# EAGLE schematic currentBaseBoard_v5 (EAGLE 9.5.1)
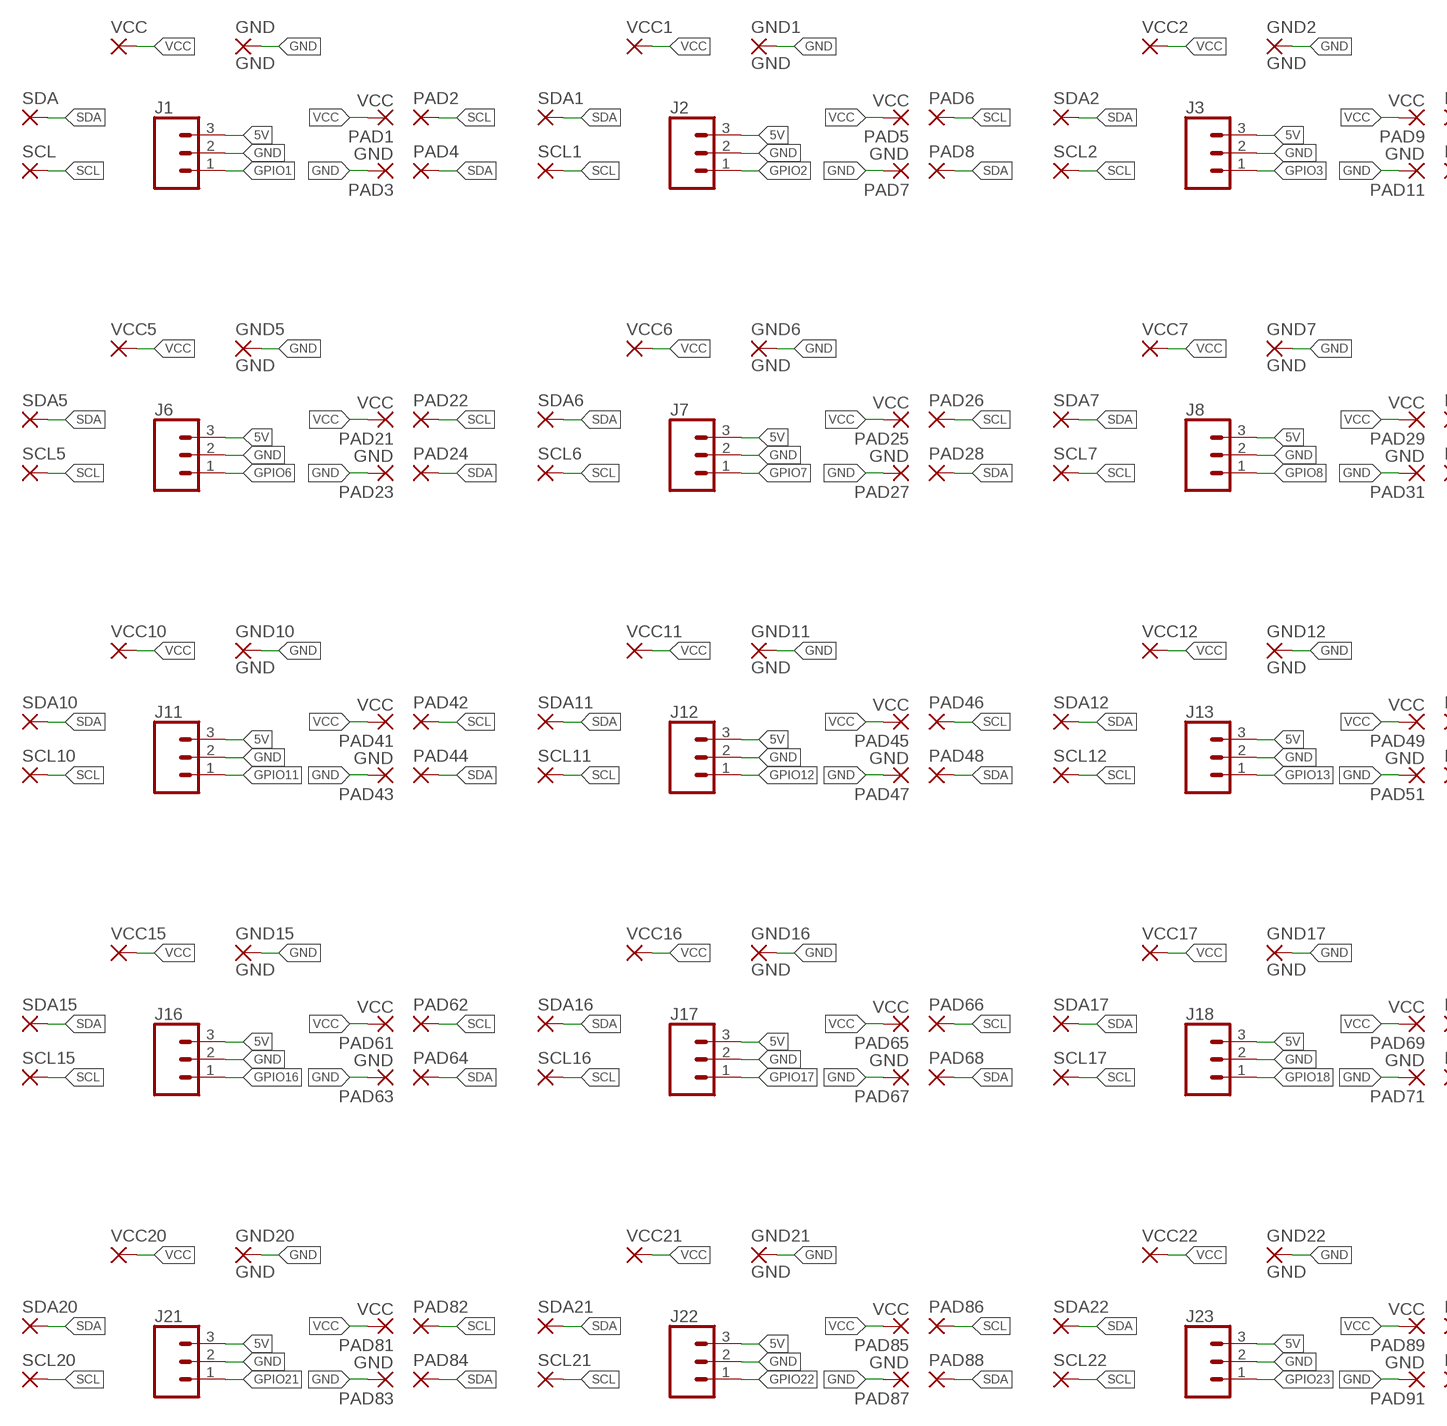
[diagram p0: schematic, sheet 1, part 1 of 2]
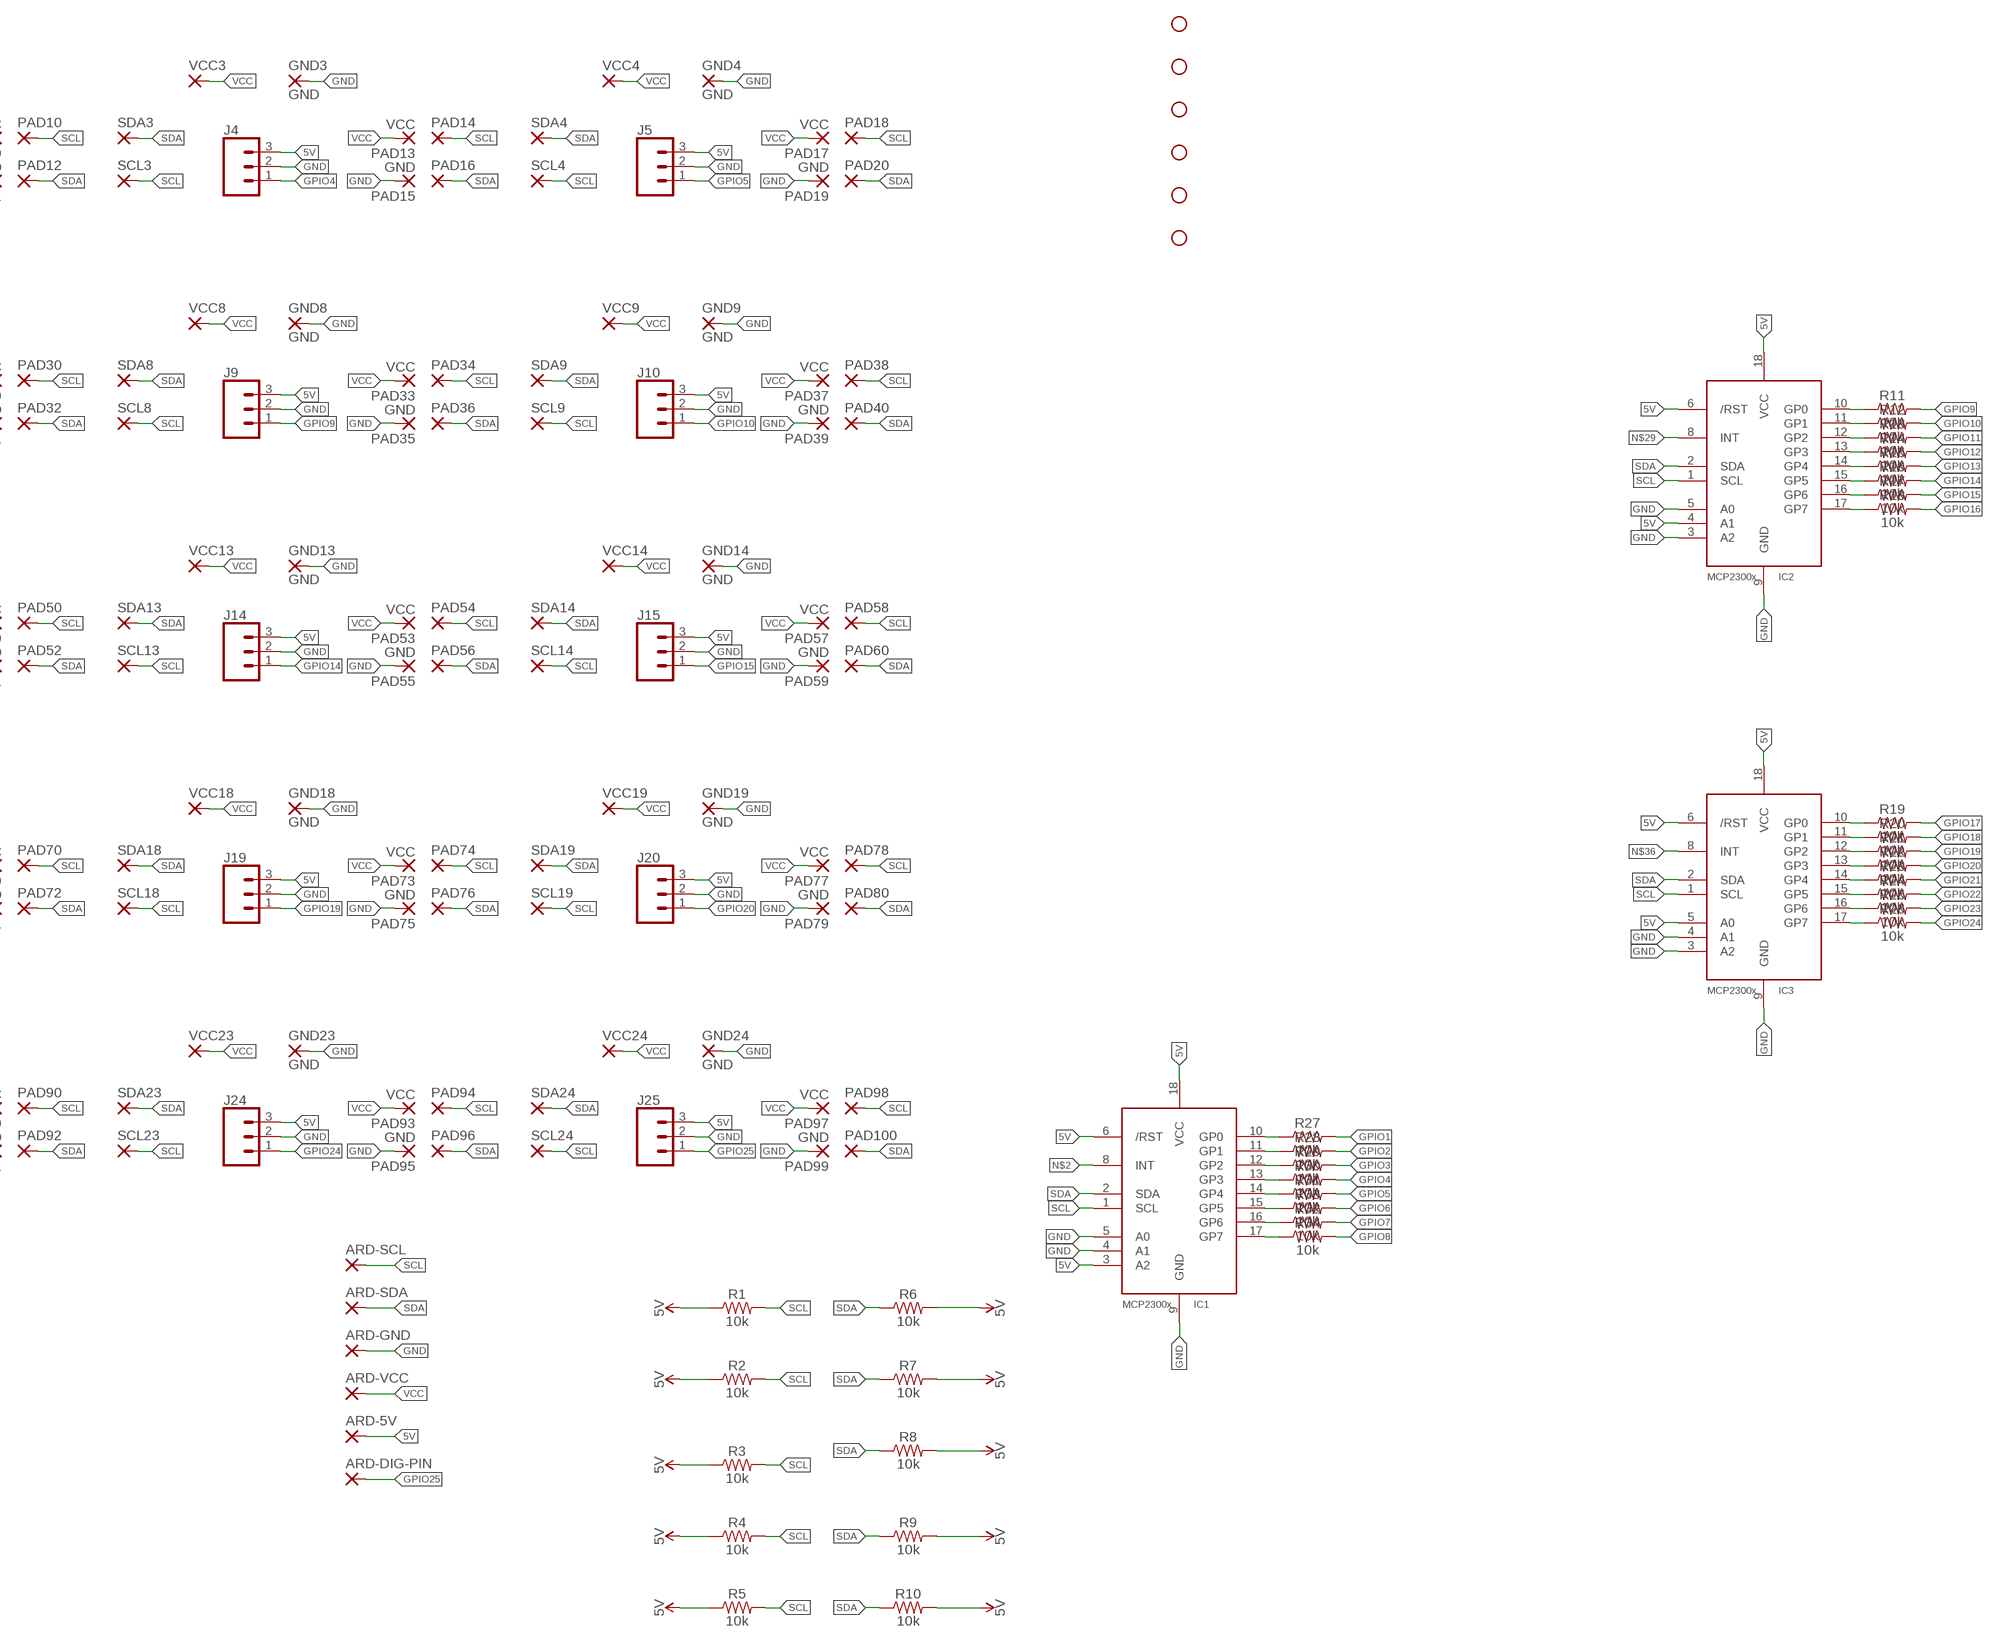
[diagram p1: schematic, sheet 1, part 2 of 2]

## Parts
ARD-5V  2,15/1,0  [2,15/1,0]
ARD-DIG-PIN  2,15/1,0  [2,15/1,0]
ARD-GND  2,15/1,0  [2,15/1,0]
ARD-SCL  2,15/1,0  [2,15/1,0]
ARD-SDA  2,15/1,0  [2,15/1,0]
ARD-VCC  2,15/1,0  [2,15/1,0]
GND  GND  2,15/1,0  [2,15/1,0]
GND1  GND  2,15/1,0  [2,15/1,0]
GND2  GND  2,15/1,0  [2,15/1,0]
GND3  GND  2,15/1,0  [2,15/1,0]
GND4  GND  2,15/1,0  [2,15/1,0]
GND5  GND  2,15/1,0  [2,15/1,0]
GND6  GND  2,15/1,0  [2,15/1,0]
GND7  GND  2,15/1,0  [2,15/1,0]
GND8  GND  2,15/1,0  [2,15/1,0]
GND9  GND  2,15/1,0  [2,15/1,0]
GND10  GND  2,15/1,0  [2,15/1,0]
GND11  GND  2,15/1,0  [2,15/1,0]
GND12  GND  2,15/1,0  [2,15/1,0]
GND13  GND  2,15/1,0  [2,15/1,0]
GND14  GND  2,15/1,0  [2,15/1,0]
GND15  GND  2,15/1,0  [2,15/1,0]
GND16  GND  2,15/1,0  [2,15/1,0]
GND17  GND  2,15/1,0  [2,15/1,0]
GND18  GND  2,15/1,0  [2,15/1,0]
GND19  GND  2,15/1,0  [2,15/1,0]
GND20  GND  2,15/1,0  [2,15/1,0]
GND21  GND  2,15/1,0  [2,15/1,0]
GND22  GND  2,15/1,0  [2,15/1,0]
GND23  GND  2,15/1,0  [2,15/1,0]
GND24  GND  2,15/1,0  [2,15/1,0]
H1  STAND-OFF  [STAND-OFF]
H2  STAND-OFF  [STAND-OFF]
H3  STAND-OFF  [STAND-OFF]
H4  STAND-OFF  [STAND-OFF]
H5  STAND-OFF  [STAND-OFF]
H6  STAND-OFF  [STAND-OFF]
IC1  MCP23008/P  [DIL18]
IC2  MCP23008/P  [DIL18]
IC3  MCP23008/P  [DIL18]
J1  CONN_03  [1X03]
J2  CONN_03  [1X03]
J3  CONN_03  [1X03]
J4  CONN_03  [1X03]
J5  CONN_03  [1X03]
J6  CONN_03  [1X03]
J7  CONN_03  [1X03]
J8  CONN_03  [1X03]
J9  CONN_03  [1X03]
J10  CONN_03  [1X03]
J11  CONN_03  [1X03]
J12  CONN_03  [1X03]
J13  CONN_03  [1X03]
J14  CONN_03  [1X03]
J15  CONN_03  [1X03]
J16  CONN_03  [1X03]
J17  CONN_03  [1X03]
J18  CONN_03  [1X03]
J19  CONN_03  [1X03]
J20  CONN_03  [1X03]
J21  CONN_03  [1X03]
J22  CONN_03  [1X03]
J23  CONN_03  [1X03]
J24  CONN_03  [1X03]
J25  CONN_03  [1X03]
PAD1  VCC  2,15/1,0  [2,15/1,0]
PAD2  2,15/1,0  [2,15/1,0]
PAD3  GND  2,15/1,0  [2,15/1,0]
PAD4  2,15/1,0  [2,15/1,0]
PAD5  VCC  2,15/1,0  [2,15/1,0]
PAD6  2,15/1,0  [2,15/1,0]
PAD7  GND  2,15/1,0  [2,15/1,0]
PAD8  2,15/1,0  [2,15/1,0]
PAD9  VCC  2,15/1,0  [2,15/1,0]
PAD10  2,15/1,0  [2,15/1,0]
PAD11  GND  2,15/1,0  [2,15/1,0]
PAD12  2,15/1,0  [2,15/1,0]
PAD13  VCC  2,15/1,0  [2,15/1,0]
PAD14  2,15/1,0  [2,15/1,0]
PAD15  GND  2,15/1,0  [2,15/1,0]
PAD16  2,15/1,0  [2,15/1,0]
PAD17  VCC  2,15/1,0  [2,15/1,0]
PAD18  2,15/1,0  [2,15/1,0]
PAD19  GND  2,15/1,0  [2,15/1,0]
PAD20  2,15/1,0  [2,15/1,0]
PAD21  VCC  2,15/1,0  [2,15/1,0]
PAD22  2,15/1,0  [2,15/1,0]
PAD23  GND  2,15/1,0  [2,15/1,0]
PAD24  2,15/1,0  [2,15/1,0]
PAD25  VCC  2,15/1,0  [2,15/1,0]
PAD26  2,15/1,0  [2,15/1,0]
PAD27  GND  2,15/1,0  [2,15/1,0]
PAD28  2,15/1,0  [2,15/1,0]
PAD29  VCC  2,15/1,0  [2,15/1,0]
PAD30  2,15/1,0  [2,15/1,0]
PAD31  GND  2,15/1,0  [2,15/1,0]
PAD32  2,15/1,0  [2,15/1,0]
PAD33  VCC  2,15/1,0  [2,15/1,0]
PAD34  2,15/1,0  [2,15/1,0]
PAD35  GND  2,15/1,0  [2,15/1,0]
PAD36  2,15/1,0  [2,15/1,0]
PAD37  VCC  2,15/1,0  [2,15/1,0]
PAD38  2,15/1,0  [2,15/1,0]
PAD39  GND  2,15/1,0  [2,15/1,0]
PAD40  2,15/1,0  [2,15/1,0]
PAD41  VCC  2,15/1,0  [2,15/1,0]
PAD42  2,15/1,0  [2,15/1,0]
PAD43  GND  2,15/1,0  [2,15/1,0]
PAD44  2,15/1,0  [2,15/1,0]
PAD45  VCC  2,15/1,0  [2,15/1,0]
PAD46  2,15/1,0  [2,15/1,0]
PAD47  GND  2,15/1,0  [2,15/1,0]
PAD48  2,15/1,0  [2,15/1,0]
PAD49  VCC  2,15/1,0  [2,15/1,0]
PAD50  2,15/1,0  [2,15/1,0]
PAD51  GND  2,15/1,0  [2,15/1,0]
PAD52  2,15/1,0  [2,15/1,0]
PAD53  VCC  2,15/1,0  [2,15/1,0]
PAD54  2,15/1,0  [2,15/1,0]
PAD55  GND  2,15/1,0  [2,15/1,0]
PAD56  2,15/1,0  [2,15/1,0]
PAD57  VCC  2,15/1,0  [2,15/1,0]
PAD58  2,15/1,0  [2,15/1,0]
PAD59  GND  2,15/1,0  [2,15/1,0]
PAD60  2,15/1,0  [2,15/1,0]
PAD61  VCC  2,15/1,0  [2,15/1,0]
PAD62  2,15/1,0  [2,15/1,0]
PAD63  GND  2,15/1,0  [2,15/1,0]
PAD64  2,15/1,0  [2,15/1,0]
PAD65  VCC  2,15/1,0  [2,15/1,0]
PAD66  2,15/1,0  [2,15/1,0]
PAD67  GND  2,15/1,0  [2,15/1,0]
PAD68  2,15/1,0  [2,15/1,0]
PAD69  VCC  2,15/1,0  [2,15/1,0]
PAD70  2,15/1,0  [2,15/1,0]
PAD71  GND  2,15/1,0  [2,15/1,0]
PAD72  2,15/1,0  [2,15/1,0]
PAD73  VCC  2,15/1,0  [2,15/1,0]
PAD74  2,15/1,0  [2,15/1,0]
PAD75  GND  2,15/1,0  [2,15/1,0]
PAD76  2,15/1,0  [2,15/1,0]
PAD77  VCC  2,15/1,0  [2,15/1,0]
PAD78  2,15/1,0  [2,15/1,0]
PAD79  GND  2,15/1,0  [2,15/1,0]
PAD80  2,15/1,0  [2,15/1,0]
PAD81  VCC  2,15/1,0  [2,15/1,0]
PAD82  2,15/1,0  [2,15/1,0]
PAD83  GND  2,15/1,0  [2,15/1,0]
PAD84  2,15/1,0  [2,15/1,0]
PAD85  VCC  2,15/1,0  [2,15/1,0]
PAD86  2,15/1,0  [2,15/1,0]
PAD87  GND  2,15/1,0  [2,15/1,0]
PAD88  2,15/1,0  [2,15/1,0]
PAD89  VCC  2,15/1,0  [2,15/1,0]
PAD90  2,15/1,0  [2,15/1,0]
PAD91  GND  2,15/1,0  [2,15/1,0]
PAD92  2,15/1,0  [2,15/1,0]
PAD93  VCC  2,15/1,0  [2,15/1,0]
PAD94  2,15/1,0  [2,15/1,0]
PAD95  GND  2,15/1,0  [2,15/1,0]
PAD96  2,15/1,0  [2,15/1,0]
PAD97  VCC  2,15/1,0  [2,15/1,0]
PAD98  2,15/1,0  [2,15/1,0]
PAD99  GND  2,15/1,0  [2,15/1,0]
PAD100  2,15/1,0  [2,15/1,0]
R1  10k  10KOHM-HORIZ-1/4W-1%  [AXIAL-0.3]
R2  10k  10KOHM-HORIZ-1/4W-1%  [AXIAL-0.3]
R3  10k  10KOHM-HORIZ-1/4W-1%  [AXIAL-0.3]
R4  10k  10KOHM-HORIZ-1/4W-1%  [AXIAL-0.3]
R5  10k  10KOHM-HORIZ-1/4W-1%  [AXIAL-0.3]
R6  10k  10KOHM-HORIZ-1/4W-1%  [AXIAL-0.3]
R7  10k  10KOHM-HORIZ-1/4W-1%  [AXIAL-0.3]
R8  10k  10KOHM-HORIZ-1/4W-1%  [AXIAL-0.3]
R9  10k  10KOHM-HORIZ-1/4W-1%  [AXIAL-0.3]
R10  10k  10KOHM-HORIZ-1/4W-1%  [AXIAL-0.3]
R11  10k  10KOHM-HORIZ-1/6W-5%  [AXIAL-0.3]
R12  10k  10KOHM-HORIZ-1/6W-5%  [AXIAL-0.3]
R13  10k  10KOHM-HORIZ-1/6W-5%  [AXIAL-0.3]
R14  10k  10KOHM-HORIZ-1/6W-5%  [AXIAL-0.3]
R15  10k  10KOHM-HORIZ-1/6W-5%  [AXIAL-0.3]
R16  10k  10KOHM-HORIZ-1/6W-5%  [AXIAL-0.3]
R17  10k  10KOHM-HORIZ-1/6W-5%  [AXIAL-0.3]
R18  10k  10KOHM-HORIZ-1/6W-5%  [AXIAL-0.3]
R19  10k  10KOHM-HORIZ-1/6W-5%  [AXIAL-0.3]
R20  10k  10KOHM-HORIZ-1/6W-5%  [AXIAL-0.3]
R21  10k  10KOHM-HORIZ-1/6W-5%  [AXIAL-0.3]
R22  10k  10KOHM-HORIZ-1/6W-5%  [AXIAL-0.3]
R23  10k  10KOHM-HORIZ-1/6W-5%  [AXIAL-0.3]
R24  10k  10KOHM-HORIZ-1/6W-5%  [AXIAL-0.3]
R25  10k  10KOHM-HORIZ-1/6W-5%  [AXIAL-0.3]
R26  10k  10KOHM-HORIZ-1/6W-5%  [AXIAL-0.3]
R27  10k  10KOHM-HORIZ-1/6W-5%  [AXIAL-0.3]
R28  10k  10KOHM-HORIZ-1/6W-5%  [AXIAL-0.3]
R29  10k  10KOHM-HORIZ-1/6W-5%  [AXIAL-0.3]
R30  10k  10KOHM-HORIZ-1/6W-5%  [AXIAL-0.3]
R31  10k  10KOHM-HORIZ-1/6W-5%  [AXIAL-0.3]
R32  10k  10KOHM-HORIZ-1/6W-5%  [AXIAL-0.3]
R33  10k  10KOHM-HORIZ-1/6W-5%  [AXIAL-0.3]
R34  10k  10KOHM-HORIZ-1/6W-5%  [AXIAL-0.3]
SCL  2,15/1,0  [2,15/1,0]
SCL1  2,15/1,0  [2,15/1,0]
SCL2  2,15/1,0  [2,15/1,0]
SCL3  2,15/1,0  [2,15/1,0]
SCL4  2,15/1,0  [2,15/1,0]
SCL5  2,15/1,0  [2,15/1,0]
SCL6  2,15/1,0  [2,15/1,0]
SCL7  2,15/1,0  [2,15/1,0]
SCL8  2,15/1,0  [2,15/1,0]
SCL9  2,15/1,0  [2,15/1,0]
SCL10  2,15/1,0  [2,15/1,0]
SCL11  2,15/1,0  [2,15/1,0]
SCL12  2,15/1,0  [2,15/1,0]
SCL13  2,15/1,0  [2,15/1,0]
SCL14  2,15/1,0  [2,15/1,0]
SCL15  2,15/1,0  [2,15/1,0]
SCL16  2,15/1,0  [2,15/1,0]
SCL17  2,15/1,0  [2,15/1,0]
SCL18  2,15/1,0  [2,15/1,0]
SCL19  2,15/1,0  [2,15/1,0]
SCL20  2,15/1,0  [2,15/1,0]
SCL21  2,15/1,0  [2,15/1,0]
SCL22  2,15/1,0  [2,15/1,0]
SCL23  2,15/1,0  [2,15/1,0]
SCL24  2,15/1,0  [2,15/1,0]
SDA  2,15/1,0  [2,15/1,0]
SDA1  2,15/1,0  [2,15/1,0]
SDA2  2,15/1,0  [2,15/1,0]
SDA3  2,15/1,0  [2,15/1,0]
SDA4  2,15/1,0  [2,15/1,0]
SDA5  2,15/1,0  [2,15/1,0]
SDA6  2,15/1,0  [2,15/1,0]
SDA7  2,15/1,0  [2,15/1,0]
SDA8  2,15/1,0  [2,15/1,0]
SDA9  2,15/1,0  [2,15/1,0]
SDA10  2,15/1,0  [2,15/1,0]
SDA11  2,15/1,0  [2,15/1,0]
SDA12  2,15/1,0  [2,15/1,0]
SDA13  2,15/1,0  [2,15/1,0]
SDA14  2,15/1,0  [2,15/1,0]
SDA15  2,15/1,0  [2,15/1,0]
SDA16  2,15/1,0  [2,15/1,0]
SDA17  2,15/1,0  [2,15/1,0]
SDA18  2,15/1,0  [2,15/1,0]
SDA19  2,15/1,0  [2,15/1,0]
SDA20  2,15/1,0  [2,15/1,0]
SDA21  2,15/1,0  [2,15/1,0]
SDA22  2,15/1,0  [2,15/1,0]
SDA23  2,15/1,0  [2,15/1,0]
SDA24  2,15/1,0  [2,15/1,0]
VCC  2,15/1,0  [2,15/1,0]
VCC1  2,15/1,0  [2,15/1,0]
VCC2  2,15/1,0  [2,15/1,0]
VCC3  2,15/1,0  [2,15/1,0]
VCC4  2,15/1,0  [2,15/1,0]
VCC5  2,15/1,0  [2,15/1,0]
VCC6  2,15/1,0  [2,15/1,0]
VCC7  2,15/1,0  [2,15/1,0]
VCC8  2,15/1,0  [2,15/1,0]
VCC9  2,15/1,0  [2,15/1,0]
VCC10  2,15/1,0  [2,15/1,0]
VCC11  2,15/1,0  [2,15/1,0]
VCC12  2,15/1,0  [2,15/1,0]
VCC13  2,15/1,0  [2,15/1,0]
VCC14  2,15/1,0  [2,15/1,0]
VCC15  2,15/1,0  [2,15/1,0]
VCC16  2,15/1,0  [2,15/1,0]
VCC17  2,15/1,0  [2,15/1,0]
VCC18  2,15/1,0  [2,15/1,0]
VCC19  2,15/1,0  [2,15/1,0]
VCC20  2,15/1,0  [2,15/1,0]
VCC21  2,15/1,0  [2,15/1,0]
VCC22  2,15/1,0  [2,15/1,0]
VCC23  2,15/1,0  [2,15/1,0]
VCC24  2,15/1,0  [2,15/1,0]

## Nets
5V: ARD-5V.1(P) IC1.3(A2) IC1.6(/RST) IC1.18(VCC) IC2.4(A1) IC2.6(/RST) IC2.18(VCC) IC3.5(A0) IC3.6(/RST) IC3.18(VCC) J1.3 J2.3 J3.3 J4.3 J5.3 J6.3 J7.3 J8.3 J9.3 J10.3 J11.3 J12.3 J13.3 J14.3 J15.3 J16.3 J17.3 J18.3 J19.3 J20.3 J21.3 J22.3 J23.3 J24.3 J25.3 R1.P$1 R2.P$1 R3.P$1 R4.P$1 R5.P$1 R6.P$2 R7.P$2 R8.P$2 R9.P$2 R10.P$2
GND: ARD-GND.1(P) GND1.1(P) GND2.1(P) GND3.1(P) GND4.1(P) GND5.1(P) GND6.1(P) GND7.1(P) GND8.1(P) GND9.1(P) GND10.1(P) GND11.1(P) GND12.1(P) GND13.1(P) GND14.1(P) GND15.1(P) GND16.1(P) GND17.1(P) GND18.1(P) GND19.1(P) GND20.1(P) GND21.1(P) GND22.1(P) GND23.1(P) GND24.1(P) GND.1(P) IC1.4(A1) IC1.5(A0) IC1.9(GND) IC2.3(A2) IC2.5(A0) IC2.9(GND) IC3.3(A2) IC3.4(A1) IC3.9(GND) J1.2 J2.2 J3.2 J4.2 J5.2 J6.2 J7.2 J8.2 J9.2 J10.2 J11.2 J12.2 J13.2 J14.2 J15.2 J16.2 J17.2 J18.2 J19.2 J20.2 J21.2 J22.2 J23.2 J24.2 J25.2 PAD3.1(P) PAD7.1(P) PAD11.1(P) PAD15.1(P) PAD19.1(P) PAD23.1(P) PAD27.1(P) PAD31.1(P) PAD35.1(P) PAD39.1(P) PAD43.1(P) PAD47.1(P) PAD51.1(P) PAD55.1(P) PAD59.1(P) PAD63.1(P) PAD67.1(P) PAD71.1(P) PAD75.1(P) PAD79.1(P) PAD83.1(P) PAD87.1(P) PAD91.1(P) PAD95.1(P) PAD99.1(P)
GPIO1: J1.1 R27.P$2
GPIO2: J2.1 R28.P$2
GPIO3: J3.1 R29.P$2
GPIO4: J4.1 R30.P$2
GPIO5: J5.1 R31.P$2
GPIO6: J6.1 R33.P$2
GPIO7: J7.1 R32.P$2
GPIO8: J8.1 R34.P$2
GPIO9: J9.1 R11.P$2
GPIO10: J10.1 R12.P$2
GPIO11: J11.1 R13.P$2
GPIO12: J12.1 R14.P$2
GPIO13: J13.1 R15.P$2
GPIO14: J14.1 R16.P$2
GPIO15: J15.1 R17.P$2
GPIO16: J16.1 R18.P$2
GPIO17: J17.1 R19.P$2
GPIO18: J18.1 R20.P$2
GPIO19: J19.1 R21.P$2
GPIO20: J20.1 R22.P$2
GPIO21: J21.1 R23.P$2
GPIO22: J22.1 R24.P$2
GPIO23: J23.1 R25.P$2
GPIO24: J24.1 R26.P$2
GPIO25: ARD-DIG-PIN.1(P) J25.1
N$1: IC1.10(GP0) R27.P$1
N$2: IC1.8(INT)
N$3: IC1.11(GP1) R28.P$1
N$4: IC1.12(GP2) R29.P$1
N$5: IC1.13(GP3) R30.P$1
N$6: IC1.14(GP4) R31.P$1
N$7: IC1.15(GP5) R33.P$1
N$8: IC1.16(GP6) R32.P$1
N$9: IC1.17(GP7) R34.P$1
N$10: IC2.10(GP0) R11.P$1
N$12: IC2.11(GP1) R12.P$1
N$13: IC2.12(GP2) R13.P$1
N$14: IC2.13(GP3) R14.P$1
N$15: IC2.14(GP4) R15.P$1
N$16: IC2.15(GP5) R16.P$1
N$17: IC2.16(GP6) R17.P$1
N$18: IC2.17(GP7) R18.P$1
N$19: IC3.10(GP0) R19.P$1
N$20: IC3.11(GP1) R20.P$1
N$21: IC3.12(GP2) R21.P$1
N$22: IC3.13(GP3) R22.P$1
N$23: IC3.14(GP4) R23.P$1
N$24: IC3.15(GP5) R24.P$1
N$25: IC3.16(GP6) R25.P$1
N$26: IC3.17(GP7) R26.P$1
N$29: IC2.8(INT)
N$36: IC3.8(INT)
SCL: ARD-SCL.1(P) IC1.1(SCL) IC2.1(SCL) IC3.1(SCL) PAD2.1(P) PAD6.1(P) PAD10.1(P) PAD14.1(P) PAD18.1(P) PAD22.1(P) PAD26.1(P) PAD30.1(P) PAD34.1(P) PAD38.1(P) PAD42.1(P) PAD46.1(P) PAD50.1(P) PAD54.1(P) PAD58.1(P) PAD62.1(P) PAD66.1(P) PAD70.1(P) PAD74.1(P) PAD78.1(P) PAD82.1(P) PAD86.1(P) PAD90.1(P) PAD94.1(P) PAD98.1(P) R1.P$2 R2.P$2 R3.P$2 R4.P$2 R5.P$2 SCL1.1(P) SCL2.1(P) SCL3.1(P) SCL4.1(P) SCL5.1(P) SCL6.1(P) SCL7.1(P) SCL8.1(P) SCL9.1(P) SCL10.1(P) SCL11.1(P) SCL12.1(P) SCL13.1(P) SCL14.1(P) SCL15.1(P) SCL16.1(P) SCL17.1(P) SCL18.1(P) SCL19.1(P) SCL20.1(P) SCL21.1(P) SCL22.1(P) SCL23.1(P) SCL24.1(P) SCL.1(P)
SDA: ARD-SDA.1(P) IC1.2(SDA) IC2.2(SDA) IC3.2(SDA) PAD4.1(P) PAD8.1(P) PAD12.1(P) PAD16.1(P) PAD20.1(P) PAD24.1(P) PAD28.1(P) PAD32.1(P) PAD36.1(P) PAD40.1(P) PAD44.1(P) PAD48.1(P) PAD52.1(P) PAD56.1(P) PAD60.1(P) PAD64.1(P) PAD68.1(P) PAD72.1(P) PAD76.1(P) PAD80.1(P) PAD84.1(P) PAD88.1(P) PAD92.1(P) PAD96.1(P) PAD100.1(P) R6.P$1 R7.P$1 R8.P$1 R9.P$1 R10.P$1 SDA1.1(P) SDA2.1(P) SDA3.1(P) SDA4.1(P) SDA5.1(P) SDA6.1(P) SDA7.1(P) SDA8.1(P) SDA9.1(P) SDA10.1(P) SDA11.1(P) SDA12.1(P) SDA13.1(P) SDA14.1(P) SDA15.1(P) SDA16.1(P) SDA17.1(P) SDA18.1(P) SDA19.1(P) SDA20.1(P) SDA21.1(P) SDA22.1(P) SDA23.1(P) SDA24.1(P) SDA.1(P)
VCC: ARD-VCC.1(P) PAD1.1(P) PAD5.1(P) PAD9.1(P) PAD13.1(P) PAD17.1(P) PAD21.1(P) PAD25.1(P) PAD29.1(P) PAD33.1(P) PAD37.1(P) PAD41.1(P) PAD45.1(P) PAD49.1(P) PAD53.1(P) PAD57.1(P) PAD61.1(P) PAD65.1(P) PAD69.1(P) PAD73.1(P) PAD77.1(P) PAD81.1(P) PAD85.1(P) PAD89.1(P) PAD93.1(P) PAD97.1(P) VCC1.1(P) VCC2.1(P) VCC3.1(P) VCC4.1(P) VCC5.1(P) VCC6.1(P) VCC7.1(P) VCC8.1(P) VCC9.1(P) VCC10.1(P) VCC11.1(P) VCC12.1(P) VCC13.1(P) VCC14.1(P) VCC15.1(P) VCC16.1(P) VCC17.1(P) VCC18.1(P) VCC19.1(P) VCC20.1(P) VCC21.1(P) VCC22.1(P) VCC23.1(P) VCC24.1(P) VCC.1(P)

## Library data of the parts
ARD-5V ARD-DIG-PIN ARD-GND ARD-SCL ARD-SDA ARD-VCC GND GND1-GND24 PAD1-PAD100 SCL SCL1-SCL24 SDA SDA1-SDA24 VCC VCC1-VCC24 = wirepad:2,15/1,0: THROUGH-HOLE PAD
H1-H6 = SparkFun-Hardware:STAND-OFF: Stand Off Drill holes for mechanically mounting via screws, standoffs, etc. Note: Use the keepout ring to avoid running the screw head into surrounding components. Variant Overviews STAND-OFF - Mechanical footprint for a #4 phillips button head screw. STAND-OFF-TIGHT - Mechanical footprint for a #4 phillips button head screw, Example SparkFun Products Screw - Phillips Head (1/4", 4-40, 10 pack) <https://www.sparkfun.com/products/10453> (PRT-10453) Screw - Phillips Head (1/2", 4-40, 10 pack) <https://www.sparkfun.com/products/10452> (PRT-10452) Screw - Phillips Head (3/4", 4-40, 10 pack) <https://www.sparkfun.com/products/10451> (PRT-10451) Screw - Phillips Head (1", 4-40, 10 pack) <https://www.sparkfun.com/products/10450> (PRT-10450)
IC1-IC3 = adafruit:MCP23008: MCP23008 Inexpensive i2c i/o expander - 8 general purpose i/o pins with optional pullups
J1-J25 = SparkFun-Connectors:CONN_03: Multi connection point. Often used as Generic Header-pin footprint for 0.1 inch spaced/style header connections On any of the 0.1 inch spaced packages, you can populate with these: Break Away Headers - Straight <https://www.sparkfun.com/products/116> (PRT-00116) Break Away Male Headers - Right Angle <https://www.sparkfun.com/products/553> (PRT-00553) Female Headers <https://www.sparkfun.com/products/115> (PRT-00115) Break Away Headers - Machine Pin <https://www.sparkfun.com/products/117> (PRT-00117) Break Away Female Headers - Swiss Machine Pin <https://www.sparkfun.com/products/743> (PRT-00743) Stackable Header - 3 Pin (Female, 0.1") <https://www.sparkfun.com/products/13875> (PRT-13875) For SCREWTERMINALS and SPRING TERMINALS visit here: Screw Terimnals on SparkFun.com <https://www.sparkfun.com/search/results?term=Screw+Terminals> (5mm/3.5mm/2.54mm spacing) This device is also useful as a general connection point to wire up your design to another part of your project. Our various solder wires solder well into these plated through hole pads. Hook-Up Wire - Assortment (Stranded, 22 AWG) <https://www.sparkfun.com/products/11375> (PRT-11375) Hook-Up Wire - Assortment (Solid Core, 22 AWG) <https://www.sparkfun.com/products/11367> (PRT-11367) View the entire wire category on our website here <https://www.sparkfun.com/categories/141> Special notes: Molex polarized connector foot print use with SKU : PRT-08232 with associated crimp pins and housings.
R1-R10 = SparkFun-Resistors:10KOHM: 10kΩ resistor A resistor is a passive two-terminal electrical component that implements electrical resistance as a circuit element. Resistors act to reduce current flow, and, at the same time, act to lower voltage levels within circuits. - Wikipedia; PROD_ID: RES-12183
R11-R34 = SparkFun-Resistors:10KOHM: 10kΩ resistor A resistor is a passive two-terminal electrical component that implements electrical resistance as a circuit element. Resistors act to reduce current flow, and, at the same time, act to lower voltage levels within circuits. - Wikipedia; PROD_ID: RES-08375